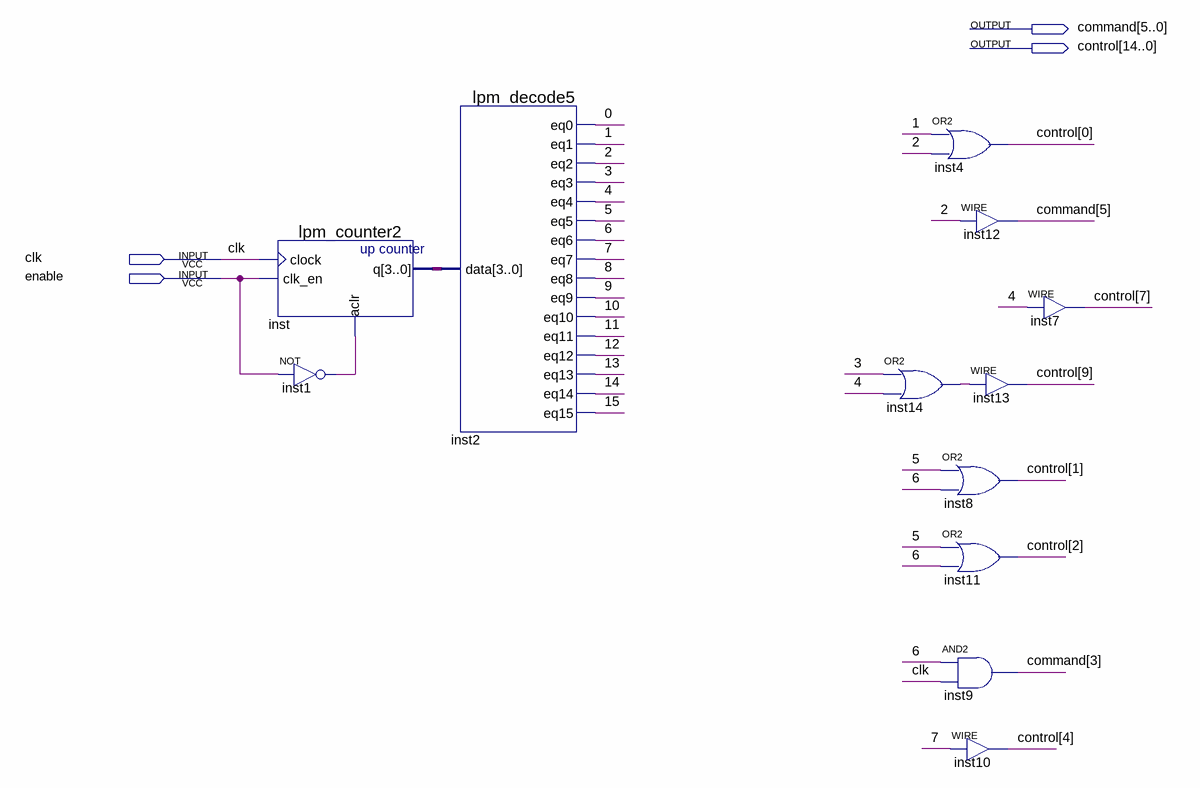
[diagram p0: schematic sheet]
// Quartus schematic mov2.bdf as structural Verilog: 12 symbols, 4 pins
module mov2 (
  input  clk,
  input  enable,
  output [5:0] command,
  output [14:0] control
);

  wire \0 , \1 , \2 , \3 , \4 , \5 , \6 , \7 , \8 , \9 , \10 , \11 , \12 , \13 , \14 , \15 , inst1_out,
       inst14_out;
  wire [3:0] inst_q;

  lpm_counter2 inst (.clock(clk), .clk_en(enable), .aclr(inst1_out), .q(inst_q));
  not inst1 (inst1_out, enable);
  lpm_decode5 inst2 (
    .data(inst_q), .eq0(\0 ), .eq1(\1 ), .eq2(\2 ), .eq3(\3 ), .eq4(\4 ), .eq5(\5 ), .eq6(\6 ), .eq7(\7 ),
    .eq8(\8 ), .eq9(\9 ), .eq10(\10 ), .eq11(\11 ), .eq12(\12 ), .eq13(\13 ), .eq14(\14 ), .eq15(\15 ));
  or inst4 (control[0], \1 , \2 );
  or inst14 (inst14_out, \3 , \4 );
  or inst8 (control[1], \5 , \6 );
  or inst11 (control[2], \5 , \6 );
  and inst9 (command[3], \6 , clk);
  assign control[4] = \7 ;  // WIRE inst10
  assign command[5] = \2 ;  // WIRE inst12
  assign control[7] = \4 ;  // WIRE inst7
  assign control[9] = inst14_out;  // WIRE inst13
endmodule
